# Altium schematic sheet Top.SchDoc
size Letter; DocumentNumber: 2; SheetNumber: 2; SheetTotal: 3
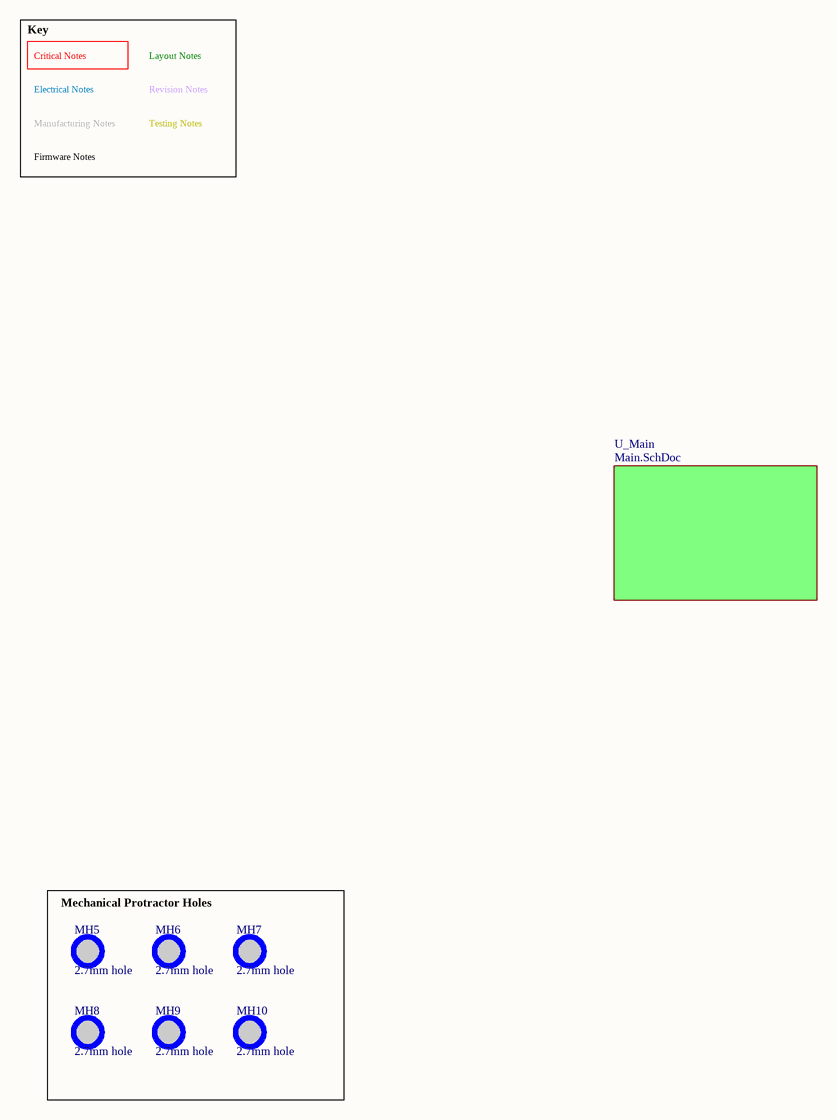
[diagram p0: Top.SchDoc]

## Parts
MH5  2.7mm hole  [2.7mm hole (no keepout)]  (no BOM)
MH6  2.7mm hole  [2.7mm hole (no keepout)]  (no BOM)
MH7  2.7mm hole  [2.7mm hole (no keepout)]  (no BOM)
MH8  2.7mm hole  [2.7mm hole (no keepout)]  (no BOM)
MH9  2.7mm hole  [2.7mm hole (no keepout)]  (no BOM)
MH10  2.7mm hole  [2.7mm hole (no keepout)]  (no BOM)

## Blocks framed on the sheet
Mechanical Protractor Holes: MH5-MH10

## Sub-sheets
U_Main = Main.SchDoc: no entries

## Notes on the sheet
- Key
- Critical Notes
- Layout Notes
- Electrical Notes
- Manufacturing Notes
- Revision Notes
- Testing Notes
- Firmware Notes
- Project
- Sheet Name
- Drawn By
- Part No
- Sheet
- of
- Revision
- Date:

## Library data of the parts
MH5-MH10 = CMP-00052-1: 2.7mm hole (no keepout) M2.5 tight; Pin Count: 0; Created By: Kylee; Component Type: Standard (No BOM)